# Altium schematic sheet Power.SchDoc
size 406 x 304 mm; SheetNumber: 5; SheetTotal: 10
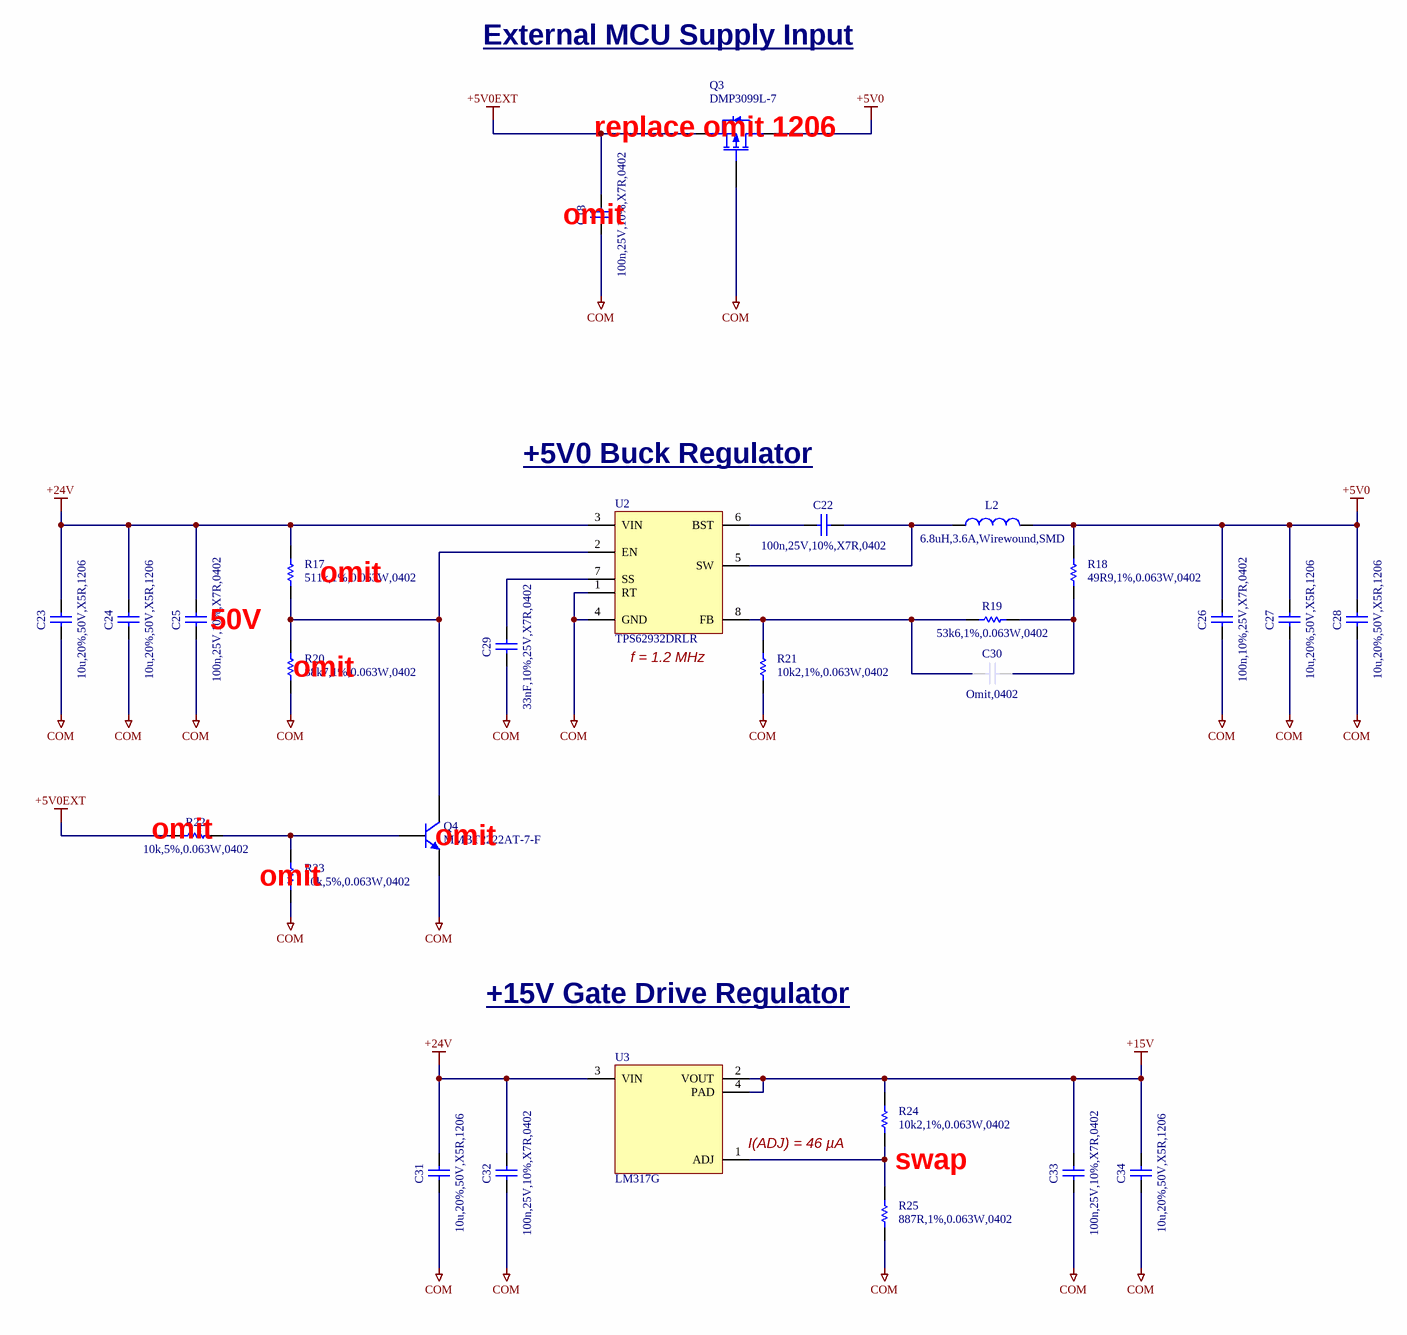
[diagram p0: Power.SchDoc]

## Parts
C18  100n,25V,10%,X7R,0402  [CAPC1005X06N]
C22  100n,25V,10%,X7R,0402  [CAPC1005X06N]
C23  10u,20%,50V,X5R,1206  [CAPC3216X16N]
C24  10u,20%,50V,X5R,1206  [CAPC3216X16N]
C25  100n,25V,10%,X7R,0402  [CAPC1005X06N]
C26  100n,10%,25V,X7R,0402  [CAPC1005X06N]
C27  10u,20%,50V,X5R,1206  [CAPC3216X16N]
C28  10u,20%,50V,X5R,1206  [CAPC3216X16N]
C29  33nF,10%,25V,X7R,0402  [CAPC1005X06N]
C30  Omit,0402  [CAPC1005X06N]  (no BOM)
C31  10u,20%,50V,X5R,1206  [CAPC3216X16N]
C32  100n,25V,10%,X7R,0402  [CAPC1005X06N]
C33  100n,25V,10%,X7R,0402  [CAPC1005X06N]
C34  10u,20%,50V,X5R,1206  [CAPC3216X16N]
L2  6.8uH,3.6A,Wirewound,SMD  [BOURNS_SRN6045TA]
Q3  DMP3099L-7  [DIODES_SOT23]
Q4  MMBT2222AT-7-F  [SOTFL50P160X90-3N]
R17  511k,1%,0.063W,0402  [RESC1005X04N]
R18  49R9,1%,0.063W,0402  [RESC1005X04N]
R19  53k6,1%,0.063W,0402  [RESC1005X04N]
R20  88k7,1%,0.063W,0402  [RESC1005X04N]
R21  10k2,1%,0.063W,0402  [RESC1005X04N]
R22  10k,5%,0.063W,0402  [RESC1005X04N]
R23  10k,5%,0.063W,0402  [RESC1005X04N]
R24  10k2,1%,0.063W,0402  [RESC1005X04N]
R25  887R,1%,0.063W,0402  [RESC1005X04N]
U2  TPS62932DRLR  [TEXASINSTRUMENTS_PKG_DRL0008A]
U3  LM317G  [UMW_PKG_SOT223-3L]

## Nets
+5V0: C26.2 C27.2 C28.2 L2.2 Q3.3(D) R18.2
+5V0EXT: C18.2 Q3.2(S) R22.2
+15V: C33.2 C34.2 R24.2 U3.2(VOUT) U3.4(PAD)
+24V: C23.2 C24.2 C25.2 C31.2 C32.2 R17.2 U2.3(VIN) U3.3(VIN)
COM: C18.1 C23.1 C24.1 C25.1 C26.1 C27.1 C28.1 C29.1 C31.1 C32.1 C33.1 C34.1 Q3.1(G) Q4.2(E) R20.1 R21.1 R23.2 R25.1 U2.1(RT) U2.4(GND)
NetC22_1: C22.1 L2.1 U2.5(SW)
NetC22_2: C22.2 U2.6(BST)
NetC29_2: C29.2 U2.7(SS)
NetC30_1: C30.1 R19.2 R21.2 U2.8(FB)
NetC30_2: C30.2 R18.1 R19.1
NetQ4_1: Q4.1(B) R22.1 R23.1
NetQ4_3: Q4.3(C) R17.1 R20.2 U2.2(EN)
NetR24_1: R24.1 R25.2 U3.1(ADJ)

## Notes on the sheet
- External MCU Supply Input
- (near Q3) replace omit 1206
- (near C18) omit
- +5V0 Buck Regulator
- (near C25) 50V
- (near R17) omit
- (near R20) omit
- (near U2) f = 1.2 MHz
- (near R22) omit
- (near R23) omit
- (near Q4) omit
- +15V Gate Drive Regulator
- I(ADJ) = 46 µA
- swap
- Sheet Name:
- Date:
- Sheet
- Designer:
- of

## Library data of the parts
C18 C22 C25 C32 C33 = CAP,Cer,100nF,10%,25VDC,X7R,0402: 0.1ï¿½F ï¿½10% 25V Ceramic Capacitor X7R 0402 (1005 Metric); Manufacturer 1: Murata Electronics; Manufacturer 1 Part Number: GRM155R71E104KE14J; Vendor 1 Part Number: 490-14603-1-ND; Vendor 1: DigiKey; Value: 100nF; Part Name: CAP,Cer,100nF,10%,25VDC,X7R,0402; CreatedBy: Judd Foster; HelpURL: https://search.murata.co.jp/Ceramy/image/img/A01X/G101/ENG/GRM155R71E104KE14-01.pdf
C23 C24 C27 C28 C31 C34 = CAP,Cer,10uF,50VDC,X5R,1206: 10ï¿½F ï¿½20% 50V Ceramic Capacitor X5R 1206 (3216 Metric); Manufacturer 1: Samsung Electro-Mechanics; Manufacturer 1 Part Number: CL31A106MBHNNNE; Vendor 1 Part Number: 1276-6736-1-ND; Vendor 1: Digikey; Part Name: CAP,Cer,10uF,50VDC,X5R,1206; CreatedBy: Judd Foster; HelpURL: https://www.samsungsem.com/resources/file/global/support/product_catalog/MLCC.pdf; Value: 10u
C26 = CAP,Cer,100nF,10%,25V,X7R,0402: 0.1ï¿½F ï¿½10% 25V Ceramic Capacitor X7R 0402 (1005 Metric); Manufacturer 1: Murata Electronics; Manufacturer 1 Part Number: GRM155R71E104KE14J; Vendor 1 Part Number: 490-14603-1-ND; Vendor 1: DigiKey; Value: 100nF; Part Name: CAP,Cer,100nF,10%,25V,X7R,0402; CreatedBy: Judd Foster; HelpURL: https://search.murata.co.jp/Ceramy/image/img/A01X/G101/ENG/GRM155R71E104KE14-01.pdf
C29 = CAP,Cer,33nF,10%,25V,X7R,0402: 0.033 ÂµF Â±10% 25V Ceramic Capacitor X7R 0402 (1005 Metric); Manufacturer 1: Murata Electronics; Manufacturer 1 Part Number: GRM155R71E333KA88D; Vendor 1 Part Number: 490-3253-1-ND; Vendor 1: DigiKey; Part Name: CAP,Cer,33nF,10%,25V,X7R,0402; CreatedBy: Judd Foster; HelpURL: https://search.murata.co.jp/Ceramy/image/img/A01X/G101/ENG/GRM155R71E333KA88-01.pdf; Value: 33nF
C30 = CAP,Omit,0402: Omit; Part Name: CAP,Omit,0402; CreatedBy: Judd Foster; HelpURL: N/A; Manufacturer 1: N/A; Manufacturer 1 Part Number: N/A; Vendor 1: N/A; Vendor 1 Part Number: N/A; Value: Omit
L2 = IND,6.8uH,3.6A,Wirewound,SMD: 6.8 ÂµH Semi-Shielded Drum Core, Wirewound Inductor 3.6 A 34mOhm Nonstandard; Manufacturer 1: Bourns Inc.; Manufacturer 1 Part Number: SRN6045TA-6R8M; Vendor 1 Part Number: SRN6045TA-6R8MCT-ND; Vendor 1: DigiKey; Part Name: IND,6.8uH,3.6A,Wirewound,SMD; CreatedBy: Judd Foster; HelpURL: https://www.bourns.com/docs/Product-Datasheets/SRN6045TA.pdf; Value: 6.8uH
Q3 = MOSFET,P Ch,30V,3.8A: P-Channel 30 V 3.8A (Ta) 1.08W (Ta) Surface Mount SOT-23-3; Manufacturer 1: Diodes Incorporated; Vendor 1 Part Number: DMP3099L-7DICT-ND; Vendor 1: Digikey; Part Name: MOSFET,P Ch,30V,3.8A; CreatedBy: Judd Foster; HelpURL: https://www.diodes.com/assets/Datasheets/DMP3099L.pdf; Manufacturer 1 Part Number: DMP3099L-7
Q4 = Trans,NPN,40V,600mA,SOT523: Bipolar (BJT) Transistor NPN 40 V 600 mA 300MHz 150 mW Surface Mount SOT-523; Manufacturer 1: Diodes Incorporated; Vendor 1 Part Number: MMBT2222AT-FDICT-ND; Vendor 1: Digikey; Part Name: Trans,NPN,40V,600mA,SOT523; CreatedBy: Judd Foster; HelpURL: https://media.digikey.com/pdf/Data%20Sheets/Diodes%20PDFs/MMBT2222AT_Rev2016.pdf; Manufacturer 1 Part Number: MMBT2222AT-7-F
R17 = RES,511k,1%,0.063W,0402: 511 kOhms Â±1% 0.063W, 1/16W Chip Resistor 0402 (1005 Metric) Moisture Resistant Thick Film; Manufacturer 1: YAGEO; Manufacturer 1 Part Number: RC0402FR-07511KL; Vendor 1 Part Number: YAG3176CT-ND; Vendor 1: DigiKey; Part Name: RES,511k,1%,0.063W,0402; CreatedBy: Judd Foster; HelpURL: https://www.yageo.com/upload/media/product/products/datasheet/rchip/PYu-RC_Group_51_RoHS_L_12.pdf; Value: 511k
R18 = RES,49R9,1%,0.063W,0402: 49.9 Ohms Â±1% 0.063W, 1/16W Chip Resistor 0402 (1005 Metric) Moisture Resistant Thick Film; Manufacturer 1: YAGEO; Manufacturer 1 Part Number: RC0402FR-0749R9L; Vendor 1 Part Number: 311-49.9LRCT-ND; Vendor 1: DigiKey; Part Name: RES,49R9,1%,0.063W,0402; CreatedBy: Judd Foster; HelpURL: https://www.yageo.com/upload/media/product/products/datasheet/rchip/PYu-RC_Group_51_RoHS_L_12.pdf; Value: 49R9
R19 = RES.53k6,1%,0.063W,0402: 53.6 kOhms Â±1% 0.063W, 1/16W Chip Resistor 0402 (1005 Metric) Moisture Resistant Thick Film; Manufacturer 1: YAGEO; Manufacturer 1 Part Number: RC0402FR-0753K6L; Vendor 1 Part Number: 311-53.6KLRCT-ND; Vendor 1: DigiKey; Part Name: RES.53k6,1%,0.063W,0402; CreatedBy: Judd Foster; HelpURL: https://www.yageo.com/upload/media/product/products/datasheet/rchip/PYu-RC_Group_51_RoHS_L_12.pdf; Value: 53k6
R20 = RES,88k7,1%,0.063W,0402: 88.7 kOhms Â±1% 0.063W, 1/16W Chip Resistor 0402 (1005 Metric) Automotive AEC-Q200, Moisture Resistant Thick Film; Manufacturer 1: YAGEO; Manufacturer 1 Part Number: AC0402FR-0788K7L; Vendor 1 Part Number: 13-AC0402FR-0788K7LCT-ND; Vendor 1: DigiKey; Part Name: RES,88k7,1%,0.063W,0402; CreatedBy: Judd Foster; HelpURL: https://www.yageo.com/upload/media/product/productsearch/datasheet/rchip/PYu-AC_51_RoHS_L_10.pdf; Value: 88k7
R21 R24 = RES,10k2,1%,0.063W,0402: 10.2 kOhms Â±1% 0.063W, 1/16W Chip Resistor 0402 (1005 Metric) Moisture Resistant Thick Film; Manufacturer 1: YAGEO; Manufacturer 1 Part Number: RC0402FR-0710K2L; Vendor 1 Part Number: YAG2950CT-ND; Vendor 1: DigiKey; Part Name: RES,10k2,1%,0.063W,0402; CreatedBy: Judd Foster; HelpURL: https://www.yageo.com/upload/media/product/products/datasheet/rchip/PYu-RC_Group_51_RoHS_L_12.pdf; Value: 10k2
R22 R23 = RES,10k,5%,0.063W,0402: 10 kOhms ï¿½5% 0.063W, 1/16W Chip Resistor 0402 (1005 Metric) Automotive AEC-Q200 Thick Film; Manufacturer 1: Stackpole Electronics Inc; Manufacturer 1 Part Number: RMCF0402JT10K0; Vendor 1 Part Number: RMCF0402JT10K0CT-ND; Vendor 1: DIgikey; Part Name: RES,10k,5%,0.063W,0402; CreatedBy: Judd Foster; HelpURL: https://www.seielect.com/catalog/sei-rmcf_rmcp.pdf; Value: 10k
R25 = RES,887R,1%,0.063W,0402: 887Î© 62.5mW 50V Â±200ppm/â„ƒ Â±1% Thick Film Resistors 0402 Chip Resistor - Surface Mount ROHS; Manufacturer 1: FH (Guangdong Fenghua Advanced Tech); Manufacturer 1 Part Number: RC-02W8870FT; Vendor 1 Part Number: C321640; Vendor 1: LCSC; Part Name: RES,887R,1%,0.063W,0402; CreatedBy: Judd Foster; HelpURL: https://www.lcsc.com/datasheet/lcsc_datasheet_2411220041_FH--Guangdong-Fenghua-Advanced-Tech-RC-02W8870FT_C321640.pdf
U2 = TPS62932DRLR: Buck Switching Regulator IC Positive Adjustable 0.8V 1 Output 2A SOT-583; Manufacturer 1: Texas Instruments; Vendor 1 Part Number: 296-TPS62932DRLRCT-ND; Vendor 1: DigiKey; Part Name: TPS62932DRLR; CreatedBy: Judd Foster; HelpURL: https://www.ti.com/lit/ds/symlink/tps62932.pdf?ts=1695814293505&ref_url=https%253A%252F%252Fwww.ti.com%252Fsitesearch%252Fen-us%252Fdocs%252Funiversalsearch.tsp%253FlangPref%253Den-US%2526searchTerm%253DTPS62932DRLR%2526nr%253D12%2526login-check%253Dtrue; Manufacturer 1 Part Number: TPS62932DRLR
U3 = LM317G: 75dB@(120Hz) 2.2A Adjustable 1.2V~37V Positive electrode 40V SOT-223 Voltage Regulators - Linear, Low Drop Out (LDO) Regulators ROHS; Manufacturer 1: UMW(Youtai Semiconductor Co., Ltd.); Vendor 1 Part Number: C347367; Vendor 1: LCSC; Part Name: LM317G; CreatedBy: Judd Foster; HelpURL: https://www.lcsc.com/datasheet/lcsc_datasheet_2411131159_UMW-Youtai-Semiconductor-Co---Ltd--LM317G_C347367.pdf; Manufacturer 1 Part Number: LM317G